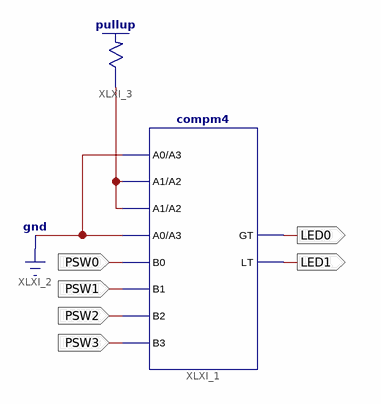
[diagram p0: schematic sheet 1]
// Xilinx ISE schematic lab5_2_comparator.sch (spartan3) as structural Verilog: 2 symbols, 6 ports
module lab5_2_comparator (
  input  PSW0,
  input  PSW1,
  input  PSW2,
  input  PSW3,
  output LED0,
  output LED1
);

  wire XLXN_3;

  \pullup  XLXI_3 (.O(XLXN_3));
  compm4 XLXI_1 (
    .A0(1'b0), .A1(XLXN_3), .A2(XLXN_3), .A3(1'b0), .B0(PSW0), .B1(PSW1), .B2(PSW2), .B3(PSW3), .GT(LED0),
    .LT(LED1));
endmodule
